# Altium schematic sheet IMU.SchDoc: IMU
size 431 x 279 mm; DocumentNumber: 15; SheetNumber: 15; SheetTotal: 18; ENG_APP_DATE: --/--/--; DSN_APP_DATE: --/--/--; CHK_APP_DATE: --/--/--
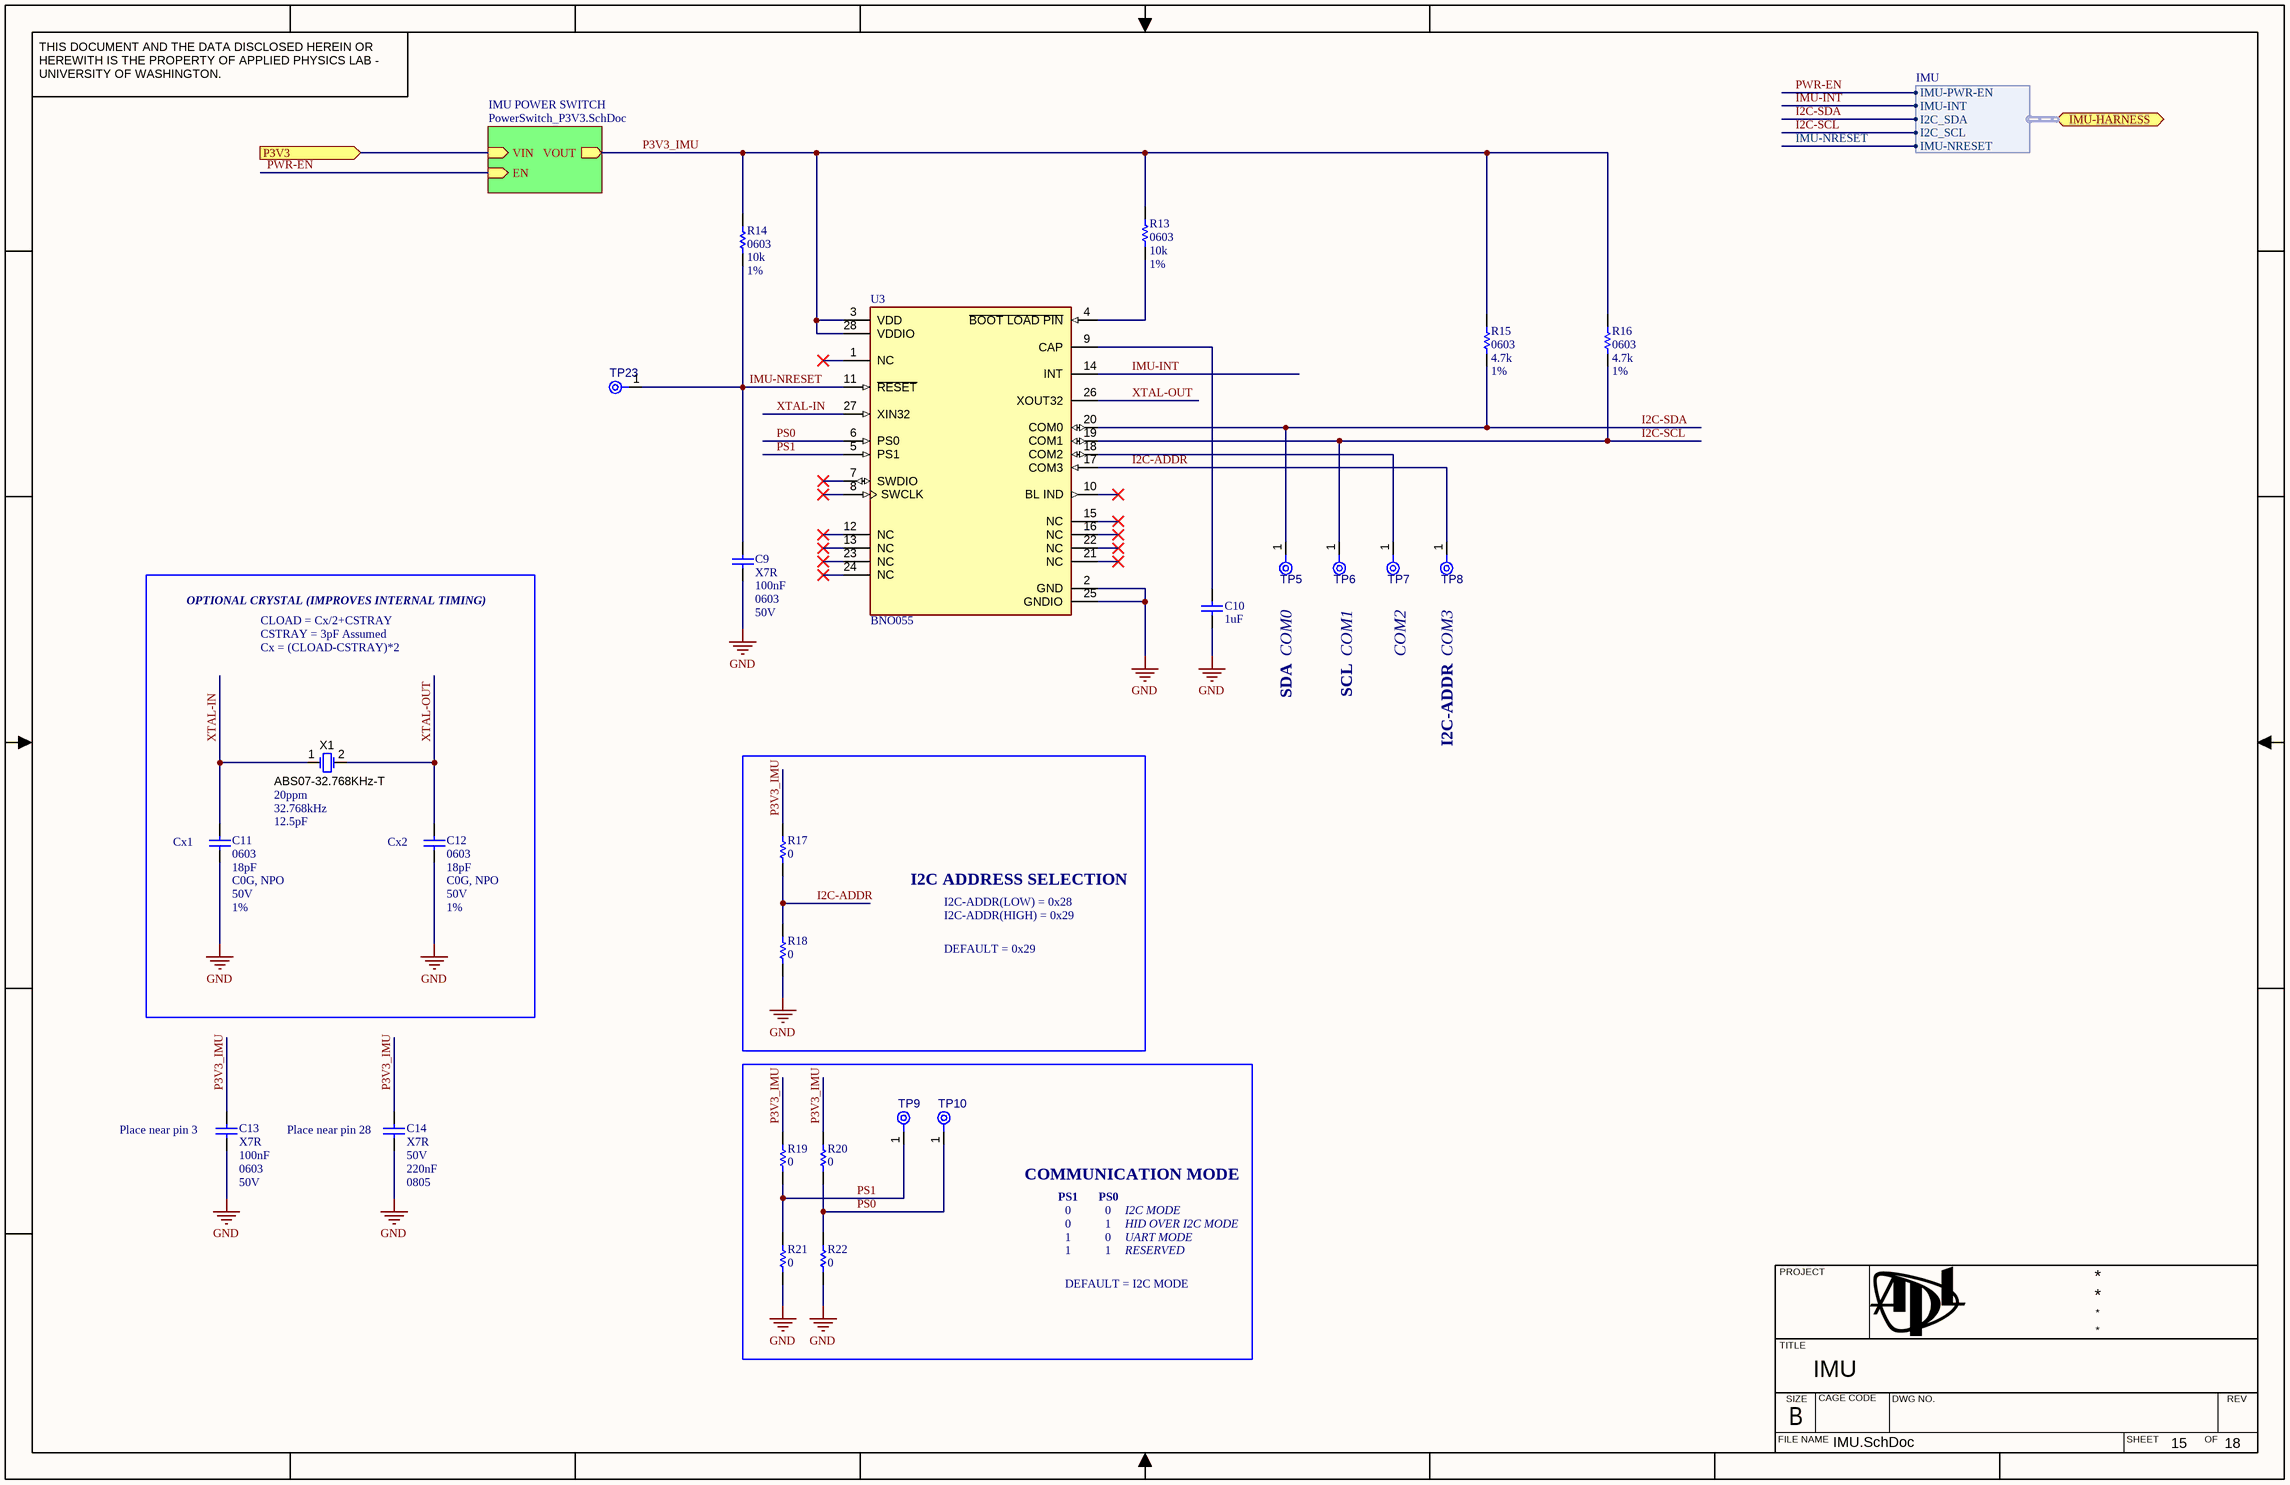
[diagram p0: IMU.SchDoc]

## Parts
C9  value 100nF  Dielectric: X7R  Case/Package: 0603  Voltage Rating: 50V  [CAPC1608X90X40ML10T20]  (hidden comment: Capacitor 100nF +/- 10%, 50V, X7R, 0603)
C10  value 1uF  [CAPC2013X95X50ML10T25]  (hidden comment: Capacitor 1uF 10%, 50V, X7R, 0805)
C11  value 18pF  Case/Package: 0603  Dielectric: C0G, NPO  Voltage Rating: 50V  Tolerance: 1%  [CAPC1608X90X40ML10T20]  (hidden comment: Capacitor 18pF +/- 1%, 50V, C0G, 0603)
C12  value 18pF  Case/Package: 0603  Dielectric: C0G, NPO  Voltage Rating: 50V  Tolerance: 1%  [CAPC1608X90X40ML10T20]  (hidden comment: Capacitor 18pF +/- 1%, 50V, C0G, 0603)
C13  value 100nF  Dielectric: X7R  Case/Package: 0603  Voltage Rating: 50V  [CAPC1608X90X40ML10T20]  (hidden comment: Capacitor 100nF +/- 10%, 50V, X7R, 0603)
C14  value 220nF  Dielectric: X7R  Voltage Rating: 50V  Case/Package: 0805  [CAPC2013X95X50ML10T25]  (hidden comment: Capacitor 220nF 10%, 50V, X7R, 0805)
R13  value 10k  Case/Package: 0603  Tolerance: 1%  [RESC1608X55X25ML10T15]  (hidden comment: Resistor 10k +/-1% 0603 100 mW)
R14  value 10k  Case/Package: 0603  Tolerance: 1%  [RESC1608X55X25ML10T15]  (hidden comment: Resistor 10k +/-1% 0603 100 mW)
R15  value 4.7k  Case/Package: 0603  Tolerance: 1%  [RESC1608X55X25ML10T15]  (hidden comment: Resistor 4k7 +/-1% 0603 100 mW)
R16  value 4.7k  Case/Package: 0603  Tolerance: 1%  [RESC1608X55X25ML10T15]  (hidden comment: Resistor 4k7 +/-1% 0603 100 mW)
R17  value 0  [RESC1608X55X25ML10T15]  (hidden comment: Resistor 0R +/- 5% 0603 100 mW)
R18  value 0  [RESC1608X55X25ML10T15]  (hidden comment: Resistor 0R +/- 5% 0603 100 mW)
R19  value 0  [RESC1608X55X25ML10T15]  (hidden comment: Resistor 0R +/- 5% 0603 100 mW)
R20  value 0  [RESC1608X55X25ML10T15]  (hidden comment: Resistor 0R +/- 5% 0603 100 mW)
R21  value 0  [RESC1608X55X25ML10T15]  (hidden comment: Resistor 0R +/- 5% 0603 100 mW)
R22  value 0  [RESC1608X55X25ML10T15]  (hidden comment: Resistor 0R +/- 5% 0603 100 mW)
TP5  TPAD6R-CIRCLED  [TP06R - Circled]  (value not drawn)  (no BOM)
TP6  TPAD6R-CIRCLED  [TP06R - Circled]  (value not drawn)  (no BOM)
TP7  TPAD6R-CIRCLED  [TP06R - Circled]  (value not drawn)  (no BOM)
TP8  TPAD6R-CIRCLED  [TP06R - Circled]  (value not drawn)  (no BOM)
TP9  TPAD6R-CIRCLED  [TP06R - Circled]  (value not drawn)  (no BOM)
TP10  TPAD6R-CIRCLED  [TP06R - Circled]  (value not drawn)  (no BOM)
TP23  TPAD6R-CIRCLED  [TP06R - Circled]  (value not drawn)  (no BOM)
U3  BNO055  [FP-BNO055-MFG]
X1  ABS07-32.768KHz-T  Frequency Tolerance: 20ppm  Frequency: 32.768kHz  Load Capacitance: 12.5pF  [ABRA-ABS07-2_V]

## Blocks framed on the sheet
I2C ADDRESS SELECTION: R17 R18
COMMUNICATION MODE: R19-R22 TP9 TP10

## Sub-sheets
IMU POWER SWITCH = PowerSwitch_P3V3.SchDoc: VOUT (out), VIN (in), EN (in)

## Ports
IMU-HARNESS (bidir, harness IMU), P3V3 (in)

## Harnesses
IMU: IMU-PWR-EN, IMU-INT, I2C_SDA, I2C_SCL, IMU-NRESET

## Nets
GND: C9.1 C10.1 C11.1 C12.1 C13.1 C14.1 R18.1 R21.1 R22.1 U3.2(GND) U3.25(GNDIO)
I2C-ADDR: R17.1 R18.2 TP8.1(TP) U3.17(COM3)
I2C-SCL: R16.1 TP6.1(TP) U3.19(COM1) ; port IMU-HARNESS.I2C_SCL
I2C-SDA: R15.1 TP5.1(TP) U3.20(COM0) ; port IMU-HARNESS.I2C_SDA
IMU-INT: U3.14(INT) ; port IMU-HARNESS.IMU-INT
IMU-NRESET: C9.2 R14.1 TP23.1(TP) U3.11(~{RESET}) ; port IMU-HARNESS.IMU-NRESET
P3V3: port P3V3, sheet IMU POWER SWITCH/VIN
P3V3_IMU: C13.2 C14.2 R13.2 R14.2 R15.2 R16.2 R17.2 R19.2 R20.2 U3.3(VDD) U3.28(VDDIO) ; sheet IMU POWER SWITCH/VOUT
PS0: R20.1 R22.2 TP10.1(TP) U3.6(PS0)
PS1: R19.1 R21.2 TP9.1(TP) U3.5(PS1)
PWR-EN: sheet IMU POWER SWITCH/EN, port IMU-HARNESS.IMU-PWR-EN
XTAL-IN: C11.2 U3.27(XIN32) X1.1(OSC1)
XTAL-OUT: C12.2 U3.26(XOUT32) X1.2(OSC2)
NetC10_2: C10.2 U3.9(CAP)
NetR13_1: R13.1 U3.4(~{BOOT_LOAD_PIN})
NetTP7_1: TP7.1(TP) U3.18(COM2)

Not connected (* = marked no-connect by the designer): U3 1(NC)* 7(SWDIO)* 8(SWCLK)* 10(BL_IND)* 12(NC)* 13(NC)* 15(NC)* 16(NC)* 21(NC)* 22(NC)* 23(NC)* 24(NC)*

## Notes on the sheet
- OPTIONAL CRYSTAL (IMPROVES INTERNAL TIMING)
- CLOAD = Cx/2+CSTRAY
- COM0
- COM1
- COM2
- COM3
- CSTRAY = 3pF Assumed
- Cx = (CLOAD-CSTRAY)*2
- SDA
- SCL
- I2C-ADDR
- (near C11) Cx1
- (near C12) Cx2
- I2C-ADDR(LOW) = 0x28
- I2C-ADDR(HIGH) = 0x29
- DEFAULT = 0x29
- (near C13) Place near pin 3
- (near C14) Place near pin 28
- PS1
- 0
- 1
- PS0
- I2C MODE
- HID OVER I2C MODE
- UART MODE
- DEFAULT = I2C MODE
- RESERVED
- THIS DOCUMENT AND THE DATA DISCLOSED HEREIN OR HEREWITH IS THE PROPERTY OF APPLIED PHYSICS LAB - UNIVERSITY OF WASHINGTON.
- PROJECT
- TITLE
- FILE NAME
- SIZE
- B
- CAGE CODE
- DWG NO.
- SHEET
- OF
- REV

## Library data of the parts
C9 C13 = CMP-001-00206-10: Chip Capacitor, 100nF, +/- 10%, 50 V, X7R 0603 (1608 Metric); Capacitor Type: Ceramic; Pins: 2; RoHS Compliant: True; Max Operating Temperature: 125°C; Capacitance: 100nF; Min Operating Temperature: -55°C; Tolerance: 10%; Decade: 100nF; Mount: Surface Mount
C10 = CMP-001-00165-11: Chip Capacitor, 1uF, 10%, 50 V, X7R 0805 (2012 Metric); Capacitor Type: Ceramic; Dielectric: X7R; RoHS Compliant: True; Max Operating Temperature: 125°C; Min Operating Temperature: -55°C; Pins: 2; Tolerance: 10%; Voltage Rating: 50V; Case/Package: 0805; Decade: 1uF; Capacitance: 1uF; Mount: Surface Mount
C11 C12 = CMP-001-00123-10: Chip Capacitor, 18pF, +/- 1%, 50 V, C0G 0603 (1608 Metric); Decade: 10pF; Capacitor Type: Ceramic; Max Operating Temperature: 125°C; Capacitance: 18pF; Min Operating Temperature: -55°C; RoHS Compliant: True; Pins: 2; Mount: Surface Mount
C14 = CMP-001-00137-11: Chip Capacitor, 220nF, 10%, 50 V, X7R 0805 (2012 Metric); Decade: 100nF; Capacitor Type: Ceramic; Pins: 2; Max Operating Temperature: 125°C; Capacitance: 220nF; Min Operating Temperature: -55°C; Tolerance: 10%; RoHS Compliant: True; Mount: Surface Mount
R13 R14 = CMP-009-00017-8: Chip Resistor, 10 KOhm, +/- 1%, 01 W, -55 to 155 degC, 0603 (1608 Metric); Voltage Rating: 50V; Power: 100mW; Min Operating Temperature: -55°C; Max Operating Temperature: 155°C; RoHS Compliant: True; Pins: 2; Decade: 10k; Mount: Surface Mount
R15 R16 = CMP-009-00031-8: Chip Resistor, 4.7 KOhm, +/- 1%, 0.1 W, -55 to 155 degC, 0603 (1608 Metric); Decade: 1k; Power: 100mW; Min Operating Temperature: -55°C; Max Operating Temperature: 155°C; RoHS Compliant: True; Pins: 2; Mount: Surface Mount
R17-R22 = CMP-009-00006-7: Chip Resistor, 0 Ohm, 0.1 W, -55 to 155 degC, 0603 (1608 Metric); Voltage Rating: 50V; Power: 100mW; RoHS Compliant: True; Max Operating Temperature: 155°C; Tolerance: 5%; Min Operating Temperature: -55°C; Case/Package: 0603; Pins: 2; Mount: Surface Mount; Decade: 0
TP5-TP10 TP23 = CMP-00028-00014-3: 0.6mm round with a silkscreen circle.; Pins: 1
U3 = CMP-010-00035-4: BNO055 Series 1.7 to 3.6 V Intelligent 9-Axis Absolute Orientation Sensor-LGA-28; Output Type: I2C; Min Input Voltage: 2.4V; Sensor Type: Accelerometer,Gyroscope,Magnetometer,3 Axis; Max Input Voltage: 3.6V; Case/Package: LGA; Mount: Surface Mount; Max Operating Temperature: 85°C; Min Operating Temperature: -40°C
X1 = CMP-003-00022-4: Low Profile Crystal, 32.768 kHz, +/- 20 ppm, 12.5 pF, -40 to 85 degC, 2-Pin SMD, Pb-Free, Tape and Reel; Manufacturer: Abracon; ESR: 70k; Max Operating Temperature: 85°C; Manufacturer URL: http://www.abracon.com/; Pins: 2; Packaging: TapeandReel; Tolerance: 20ppm; Min Operating Temperature: -40°C; Datasheet URL: http://www.abracon.com/Resonators/ABS07.pdf; RoHS Compliant: True; Package Description: 2-Pin Surface Mount Device, Body 3.2 x 1.5 mm; Datasheet Version: Aug-15; Package Reference: ABS07-2; Package URL: http://www.abracon.com/Support/PackageDrawing/Resonators/ABS07.PDF; Package Quantity: 3000; Case/Package: 2-SMD; Mount: Surface Mount